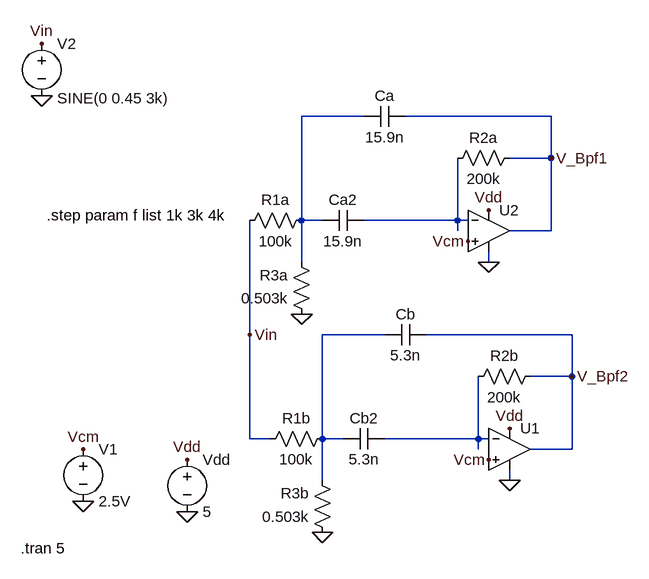
[diagram p0: schematic Exp6.asc]
Exp6.asc, the LTspice schematic file:
Version 4
SHEET 1 880 680
WIRE 32 -480 -64 -480
WIRE 320 -480 96 -480
WIRE 320 -416 320 -480
WIRE 320 -416 256 -416
WIRE -64 -320 -64 -480
WIRE -32 -320 -64 -320
WIRE 176 -320 176 -416
WIRE 176 -320 32 -320
WIRE 192 -320 176 -320
WIRE 176 -304 176 -320
WIRE 320 -304 320 -416
WIRE 320 -304 256 -304
WIRE -64 -256 -64 -320
WIRE 224 -256 224 -272
WIRE -144 -144 -144 -320
WIRE 64 -144 -32 -144
WIRE 352 -144 128 -144
WIRE 352 -80 352 -144
WIRE 352 -80 288 -80
WIRE -144 16 -144 -144
WIRE -112 16 -144 16
WIRE -32 16 -32 -144
WIRE 0 16 -32 16
WIRE 208 16 208 -80
WIRE 208 16 64 16
WIRE 224 16 208 16
WIRE 208 32 208 16
WIRE 352 32 352 -80
WIRE 352 32 288 32
WIRE -32 80 -32 16
WIRE 256 80 256 64
FLAG 256 80 0
FLAG 256 0 Vdd
FLAG -240 128 0
FLAG -240 48 Vdd
FLAG 224 48 Vcm
FLAG -400 112 0
FLAG -400 32 Vcm
FLAG -32 160 0
FLAG 224 -256 0
FLAG 224 -336 Vdd
FLAG 192 -288 Vcm
FLAG -64 -176 0
FLAG -144 -144 Vin
FLAG 320 -416 V_Bpf1
FLAG 352 -80 V_Bpf2
FLAG -464 -512 0
FLAG -464 -592 Vin
SYMBOL Opamps\\UniversalOpamp2 256 32 R0
SYMATTR InstName U1
SYMBOL voltage -240 32 R0
WINDOW 123 0 0 Left 2
WINDOW 39 0 0 Left 2
SYMATTR InstName Vdd
SYMATTR Value 5
SYMBOL voltage -400 16 R0
SYMATTR InstName V1
SYMATTR Value 2.5V
SYMBOL res 304 -96 R90
WINDOW 0 0 56 VBottom 2
WINDOW 3 32 56 VTop 2
SYMATTR InstName R2b
SYMATTR Value 200k
SYMBOL res -16 176 R180
WINDOW 0 36 76 Left 2
WINDOW 3 36 40 Left 2
SYMATTR InstName R3b
SYMATTR Value 0.503k
SYMBOL cap 64 0 R90
WINDOW 0 0 32 VBottom 2
WINDOW 3 32 32 VTop 2
SYMATTR InstName Cb2
SYMATTR Value 5.3n
SYMBOL cap 128 -160 R90
WINDOW 0 0 32 VBottom 2
WINDOW 3 32 32 VTop 2
SYMATTR InstName Cb
SYMATTR Value 5.3n
SYMBOL res -16 0 R90
WINDOW 0 0 56 VBottom 2
WINDOW 3 32 56 VTop 2
SYMATTR InstName R1b
SYMATTR Value 100k
SYMBOL Opamps\\UniversalOpamp2 224 -304 R0
SYMATTR InstName U2
SYMBOL res 272 -432 R90
WINDOW 0 0 56 VBottom 2
WINDOW 3 32 56 VTop 2
SYMATTR InstName R2a
SYMATTR Value 200k
SYMBOL res -48 -160 R180
WINDOW 0 36 76 Left 2
WINDOW 3 36 40 Left 2
SYMATTR InstName R3a
SYMATTR Value 0.503k
SYMBOL cap 32 -336 R90
WINDOW 0 0 32 VBottom 2
WINDOW 3 32 32 VTop 2
SYMATTR InstName Ca2
SYMATTR Value 15.9n
SYMBOL cap 96 -496 R90
WINDOW 0 0 32 VBottom 2
WINDOW 3 32 32 VTop 2
SYMATTR InstName Ca
SYMATTR Value 15.9n
SYMBOL res -48 -336 R90
WINDOW 0 0 56 VBottom 2
WINDOW 3 32 56 VTop 2
SYMATTR InstName R1a
SYMATTR Value 100k
SYMBOL voltage -464 -608 R0
WINDOW 3 24 100 Left 2
WINDOW 123 24 72 Left 2
WINDOW 39 0 0 Left 2
SYMATTR Value SINE(0 0.45 3k)
SYMATTR InstName V2
TEXT -456 -328 Left 2 !.step param f list 1k 3k 4k
TEXT -496 184 Left 2 !.tran 5

The netlist it stands for:
* Exp6.asc
XU1 Vcm N004 Vdd 0 V_Bpf2 level.2 Avol=1Meg GBW=10Meg Slew=10Meg ilimit=25m rail=0 Vos=0 phimargin=45 en=0 enk=0 in=0 ink=0 Rin=500Meg  ; pins IN+ IN- V+ V- OUT
Vdd Vdd 0 5
V1 Vcm 0 2.5V
R2b V_Bpf2 N004 200k
R3b 0 N003 0.503k
Cb2 N004 N003 5.3n
Cb V_Bpf2 N003 5.3n
R1b N003 Vin 100k
XU2 Vcm N002 Vdd 0 V_Bpf1 level.2 Avol=1Meg GBW=10Meg Slew=10Meg ilimit=25m rail=0 Vos=0 phimargin=45 en=0 enk=0 in=0 ink=0 Rin=500Meg  ; pins IN+ IN- V+ V- OUT
R2a V_Bpf1 N002 200k
R3a 0 N001 0.503k
Ca2 N002 N001 15.9n
Ca V_Bpf1 N001 15.9n
R1a N001 Vin 100k
V2 Vin 0 SINE(0 0.45 3k)
.step param f list 1k 3k 4k
.tran 5
.lib UniversalOpamps2.sub
.backanno
.end